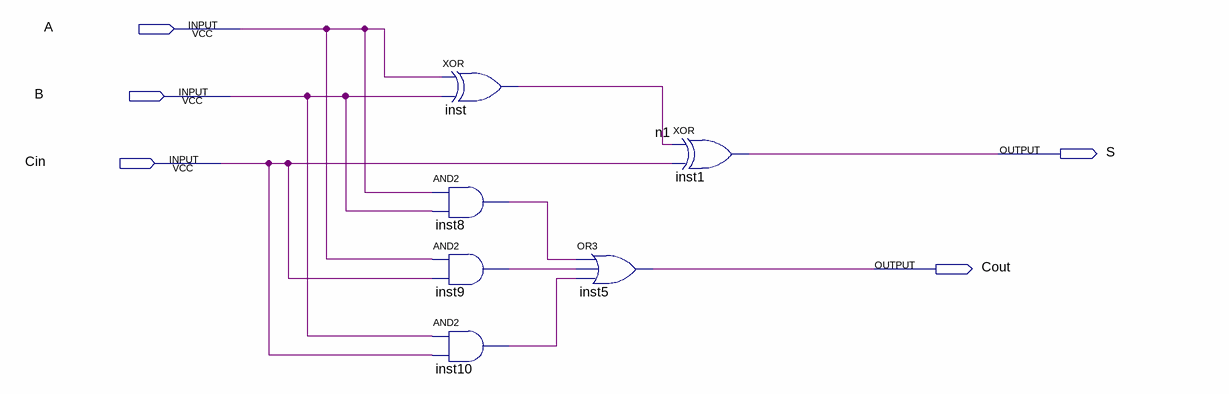
[diagram p0: schematic sheet]
// Quartus schematic full_adder.bdf as structural Verilog: 6 symbols, 5 pins
module full_adder (
  input  A,
  input  B,
  input  Cin,
  output S,
  output Cout
);

  wire inst8_out, inst9_out, inst10_out, n1;

  xor inst (n1, A, B);
  and inst8 (inst8_out, A, B);
  and inst9 (inst9_out, A, Cin);
  and inst10 (inst10_out, B, Cin);
  or inst5 (Cout, inst8_out, inst9_out, inst10_out);
  xor inst1 (S, n1, Cin);
endmodule
